# EAGLE schematic Tiny841 (EAGLE 7.2.0)
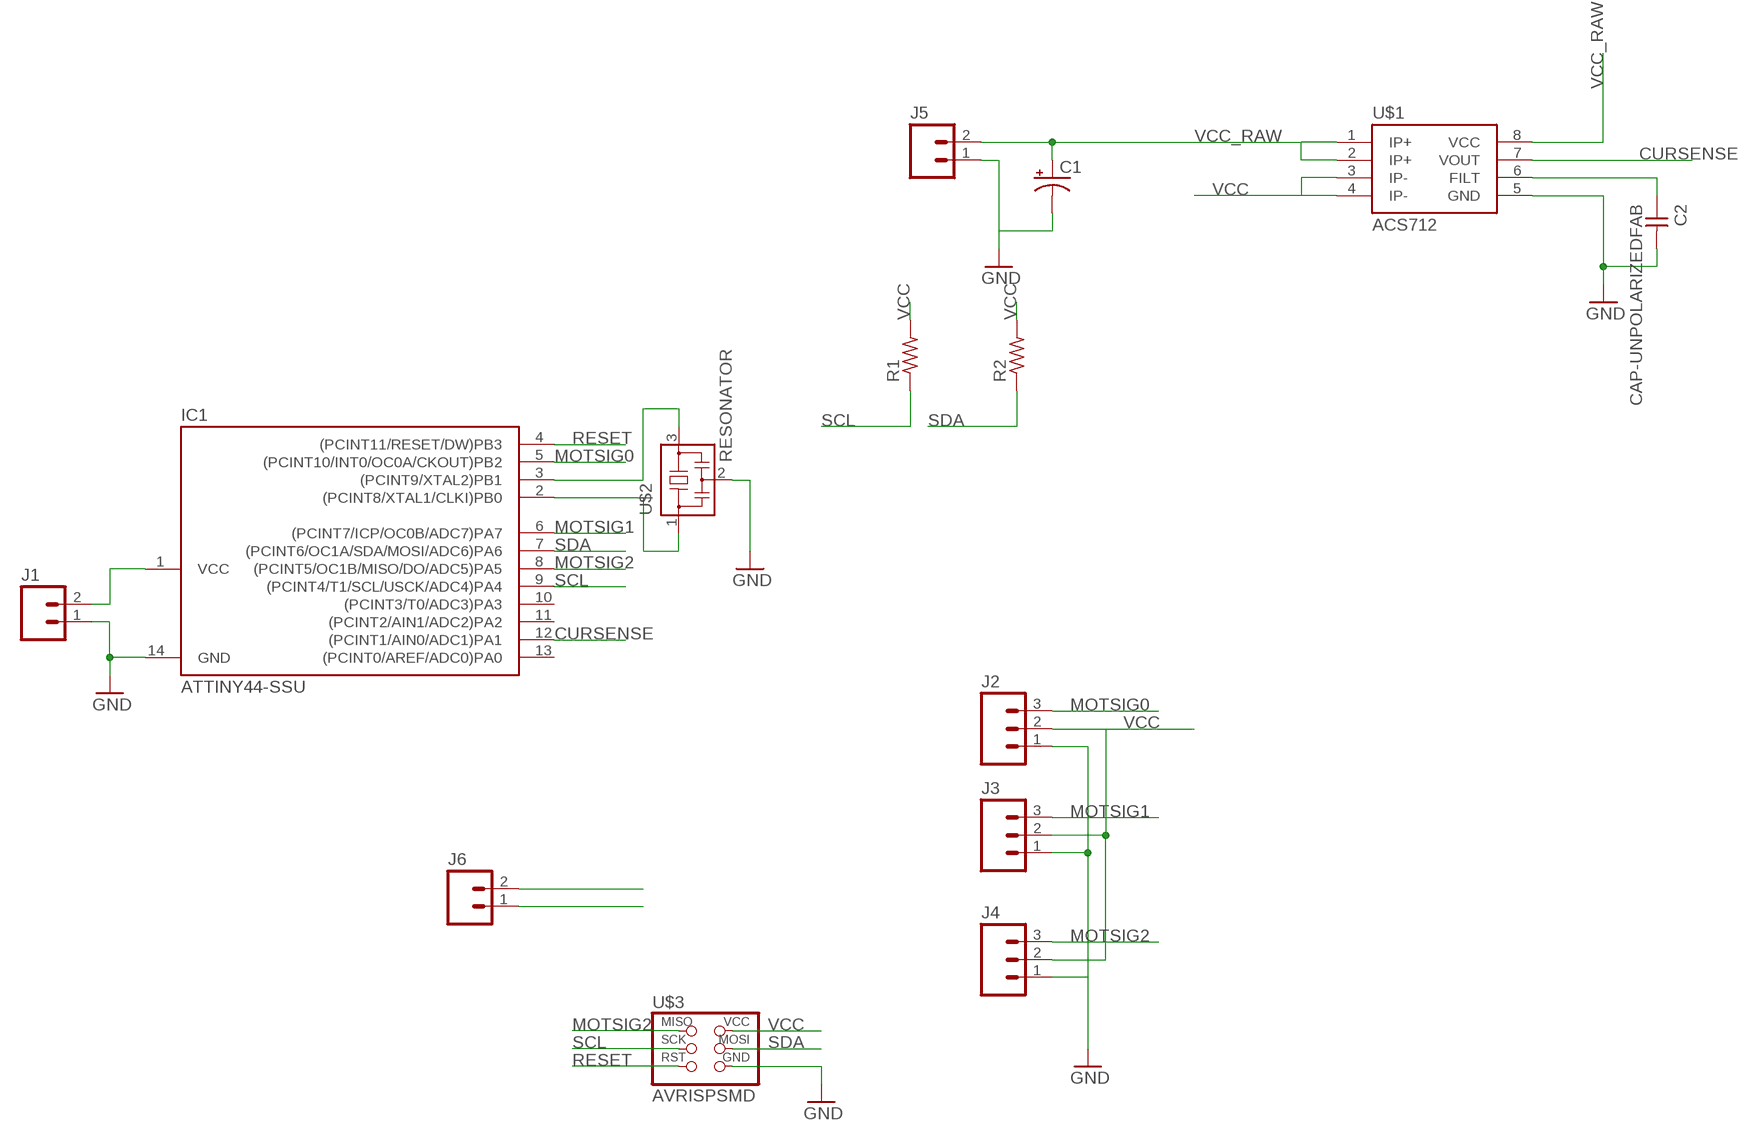
[diagram p0: schematic, sheet 1]

## Parts
C1  47UF-50V-20%(ELECT)  [PANASONIC_D]
C2  CAP-UNPOLARIZEDFAB  [C1206FAB]
IC1  ATTINY44-SSU  [SOIC14]
J1  M02PTH  [1X02]
J2  M03PTH  [1X03]
J3  M03PTH  [1X03]
J4  M03PTH  [1X03]
J5  M023.5MM-NO_SILK  [SCREWTERMINAL-3.5MM-2-NS]
J6  M02PTH  [1X02]
R1  RES-US1206FAB  [R1206FAB]
R2  RES-US1206FAB  [R1206FAB]
U$1  ACS712  [SO08]
U$2  RESONATOR  [EFOBM]
U$3  AVRISPSMD  [2X03SMD]

## Nets
CURSENSE: IC1.12((PCINT1/AIN0/ADC1)PA1) U$1.7(VOUT)
GND: C1.- C2.2 IC1.14(GND) J1.1 J2.1 J3.1 J4.1 J5.1 U$1.5(GND) U$2.2 U$3.6(GND)
MOTSIG0: IC1.5((PCINT10/INT0/OC0A/CKOUT)PB2) J2.3
MOTSIG1: IC1.6((PCINT7/ICP/OC0B/ADC7)PA7) J3.3
MOTSIG2: IC1.8((PCINT5/OC1B/MISO/DO/ADC5)PA5) J4.3 U$3.1(MISO)
N$5: IC1.3((PCINT9/XTAL2)PB1) U$2.3
N$6: IC1.2((PCINT8/XTAL1/CLKI)PB0) U$2.1
N$8: C2.1 U$1.6(FILT)
RESET: IC1.4((PCINT11/RESET/DW)PB3) U$3.5(RST)
SCL: IC1.9((PCINT4/T1/SCL/USCK/ADC4)PA4) J6.1 R1.1 U$3.3(SCK)
SDA: IC1.7((PCINT6/OC1A/SDA/MOSI/ADC6)PA6) J6.2 R2.1 U$3.4(MOSI)
VCC: IC1.1(VCC) J1.2 J2.2 J3.2 J4.2 R1.2 R2.2 U$1.3(IP-) U$1.4(IP-) U$3.2(VCC)
VCC_RAW: C1.+ J5.2 U$1.1(IP+) U$1.2(IP+) U$1.8(VCC)
Unconnected: IC1.10((PCINT3/T0/ADC3)PA3) IC1.11((PCINT2/AIN1/ADC2)PA2) IC1.13((PCINT0/AREF/ADC0)PA0)

## Library data of the parts
C1 = SparkFun-Capacitors:47UF-50V-20%(ELECT): CAP-10547; PROD_ID: CAP-10547
C2 = fab:CAP-UNPOLARIZED
IC1 = fab:ATTINY44
J1 J6 = SparkFun-Connectors:M02: Standard 2-pin 0.1" header. Use with - straight break away headers ( PRT-00116) - right angle break away headers (PRT-00553) - swiss pins (PRT-00743) - machine pins (PRT-00117) - female headers (PRT-00115) Molex polarized connector foot print use with: PRT-08233 with associated crimp pins and housings. 2.54_SCREWTERM for use with PRT-10571. 3.5mm Screw Terminal footprints for PRT-08084 5mm Screw Terminal footprints for use with PRT-08432
J2-J4 = SparkFun-Connectors:M03: Header 3 Standard 3-pin 0.1" header. Use with straight break away headers (SKU : PRT-00116), right angle break away headers (PRT-00553), swiss pins (PRT-00743), machine pins (PRT-00117), and female headers (PRT-00115). Molex polarized connector foot print use with SKU : PRT-08232 with associated crimp pins and housings.
J5 = SparkFun-Connectors:M02: Standard 2-pin 0.1" header. Use with - straight break away headers ( PRT-00116) - right angle break away headers (PRT-00553) - swiss pins (PRT-00743) - machine pins (PRT-00117) - female headers (PRT-00115) Molex polarized connector foot print use with: PRT-08233 with associated crimp pins and housings. 2.54_SCREWTERM for use with PRT-10571. 3.5mm Screw Terminal footprints for PRT-08084 5mm Screw Terminal footprints for use with PRT-08432; PROD_ID: CONN-08399
R1 R2 = fab:RES-US: Resistor (US Symbol) Variants with postfix FAB are widened to allow the routing of internal traces
U$1 = SparkFun-AnalogIC:ACS712: Hall-effect-based isolated linear current sensor; PROD_ID: IC-08964
U$2 = fab:RESONATOR
U$3 = fab:AVRISP